# Altium schematic sheet main.SchDoc
size A4; SheetNumber: 1; SheetTotal: 3
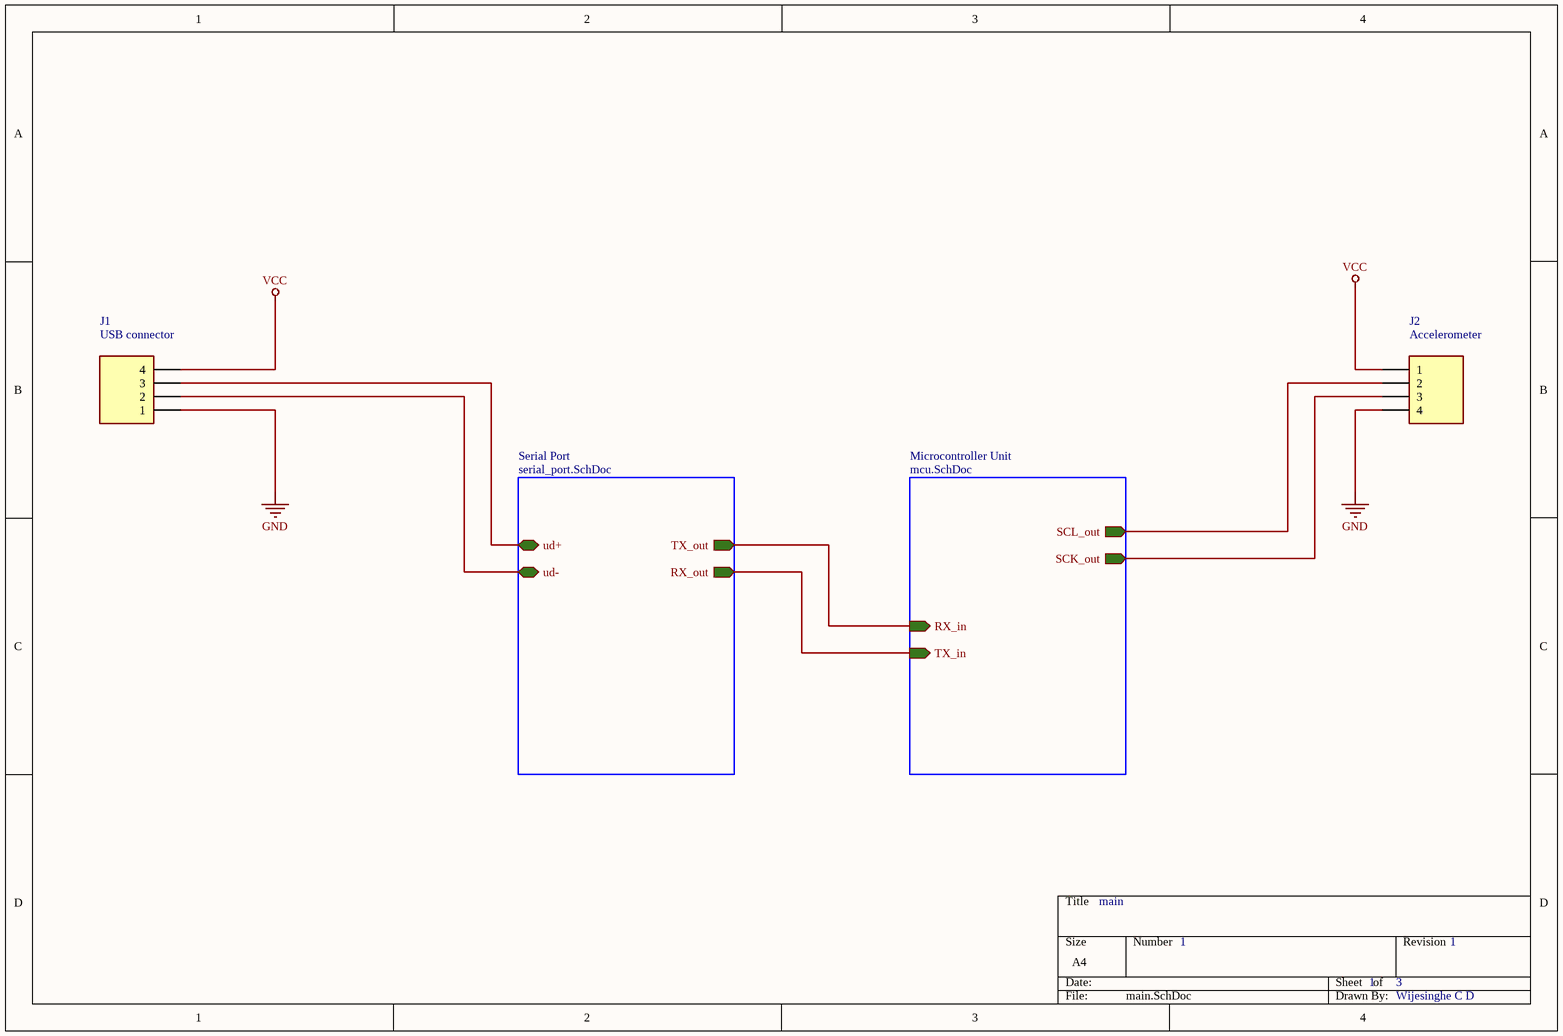
[diagram p0: main.SchDoc]

## Parts
J1  USB connector  [B04BPSILEA1LFSN]
J2  Accelerometer  [B04BPSILEA1LFSN]

## Sub-sheets
Microcontroller Unit = mcu.SchDoc: RX_in (in), TX_in (in), SCL_out (out), SCK_out (out)
Serial Port = serial_port.SchDoc: RX_out (out), TX_out (out), ud+ (bidir), ud- (bidir)

## Nets
GND: J1.1 J2.4
VCC: J1.4 J2.1
NetJ1_2: J1.2 ; sheet Serial Port/ud-
NetJ1_3: J1.3 ; sheet Serial Port/ud+
NetJ2_2: J2.2 ; sheet Microcontroller Unit/SCL_out
NetJ2_3: J2.3 ; sheet Microcontroller Unit/SCK_out
(unnamed): sheet Microcontroller Unit/RX_in, sheet Serial Port/TX_out
(unnamed): sheet Microcontroller Unit/TX_in, sheet Serial Port/RX_out

## Notes on the sheet
- main
- 1
- 3
- Wijesinghe C D

## Library data of the parts
J1 J2 = B04B-PSILE-A1_LF__SN_: Connector; Manufacturer_Name: JST (JAPAN SOLDERLESS TERMINALS); Manufacturer_Part_Number: B04B-PSILE-A1(LF)(SN); Datasheet Link: http://uk.rs-online.com/web/p/products/1383547; Height: 12.35mm